# EAGLE design LB_BIT_i15_LIGHTTRIGGER-v02(rev1) (EAGLE 6.6.0)
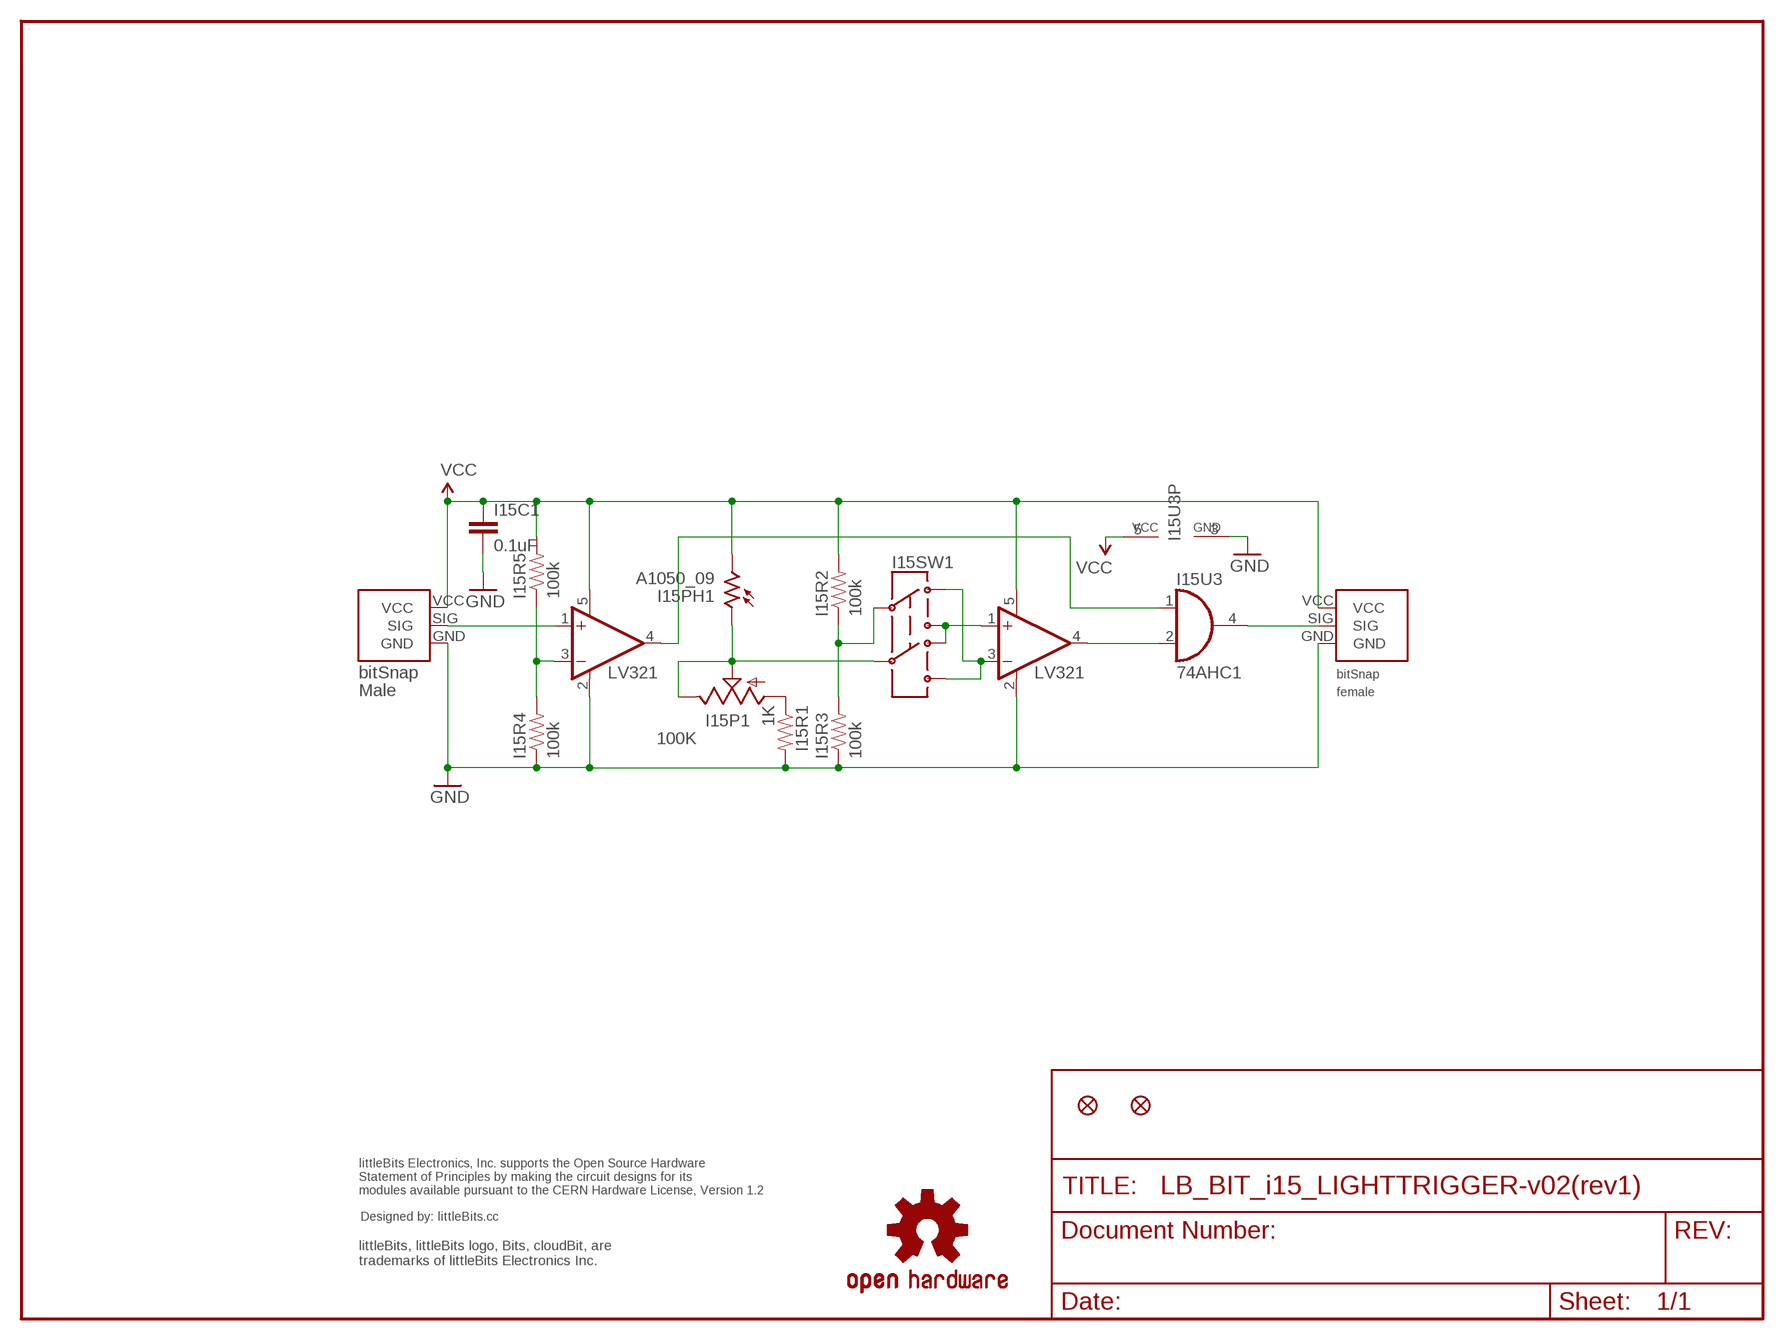
[diagram p0: schematic, sheet 1]

## Parts
I15BSF  BITSNAP_FEMALE  [BITSNAP_FEMALE]
I15BSM  BITSNAP_MALE  [BITSNAP_MALE]
I15C1  0.1uF  CAP0603-CAP  [0603-CAP]
I15FD1  FIDUCIAL1X2  [FIDUCIAL-1X2]
I15FD2  FIDUCIAL1X2  [FIDUCIAL-1X2]
I15P1  POT-TRIM-SMD-BOURNS-3303  [POT-TRIM-SMD-BOURNS-3303]
I15PH1  A1050_09  [T0-46-A10XX]
I15R1  1K  RESISTOR0603-RES  [0603-RES]
I15R2  100k  RESISTOR0603-RES  [0603-RES]
I15R3  100k  RESISTOR0603-RES  [0603-RES]
I15R4  100k  RESISTOR0603-RES  [0603-RES]
I15R5  100k  RESISTOR0603-RES  [0603-RES]
I15SW1  SWITCH-DPDTSMD  [AYZ0202]
I15U1  LV321  [SC70]
I15U2  LV321  [SC70]
I15U3  74AHC1  74LVC1G08DBV  [SOT23-5]
U$6  OSHW-LOGOL  [OSHW-LOGO-L]
U$7  OSHWCREDIT  [OSHWCREDIT]

## Nets
GND: I15BSF.GND I15BSM.GND I15C1.2 I15R1.2 I15R3.1 I15R4.1 I15U1.2(V-) I15U2.2(V-) I15U3.3(GND)
N$1: I15SW1.3 I15SW1.4 I15U2.1(+IN)
N$2: I15SW1.1 I15SW1.6 I15U2.3(-IN)
N$4: I15P1.1(A) I15R1.1
N$6: I15U2.4(OUT) I15U3.2(I1)
N$8: I15BSF.SIG I15U3.4(O)
N$9: I15R2.1 I15R3.2 I15SW1.2
N$10: I15P1.2(S) I15P1.3(E) I15PH1.1 I15SW1.5
N$11: I15BSM.SIG I15U1.1(+IN)
N$12: I15R4.2 I15R5.1 I15U1.3(-IN)
N$13: I15U1.4(OUT) I15U3.1(I0)
VCC: I15BSF.VCC I15BSM.VCC I15C1.1 I15PH1.2 I15R2.2 I15R5.2 I15U1.5(V+) I15U2.5(V+) I15U3.5(VCC)

## Notes on the sheet
- 100K

## Library data of the parts
I15BSF = bitSnap:BITSNAP_FEMALE
I15BSM = bitSnap:BITSNAP_MALE
I15C1 = SparkFun:CAP: Capacitor Standard 0603 ceramic capacitor, and 0.1" leaded capacitor.
I15FD1 I15FD2 = SparkFun:FIDUCIAL: Fiducial Alignment Points Various fiducial points for machine vision alignment.
I15P1 = LITTLEBITS:POT-TRIM-SMD-BOURNS-3303
I15PH1 = photo-elements:A10: Sensor Robust Light Sensing Applications Outdoor Light Sensing Application Source: http://optoelectronics.perkinelmer.com/content/Datasheets/DTS_PhotocellsA1050.pdf
I15R1-I15R5 = SparkFun:RESISTOR: Resistor Basic schematic elements and footprints for 0603, 1206, and PTH 1/10th watt (small) resistors.
I15SW1 = SparkFun:SWITCH-DPDT: DPDT Version of the COM-00597
I15U1 I15U2 = LITTLEBITS:LV321
I15U3 = 74xx-little-de:74*1G08: 2-input AND gate
U$6 = SparkFun_NEW:OSHW-LOGO: Open Source Hardware Logo This logo indicates the piece of hardware it is found on incorporates a OSHW license and/or adheres to the definition of open source hardware found here: http://freedomdefined.org/OSHW
U$7 = LITTLEBITS:OSHWCREDIT

## Board
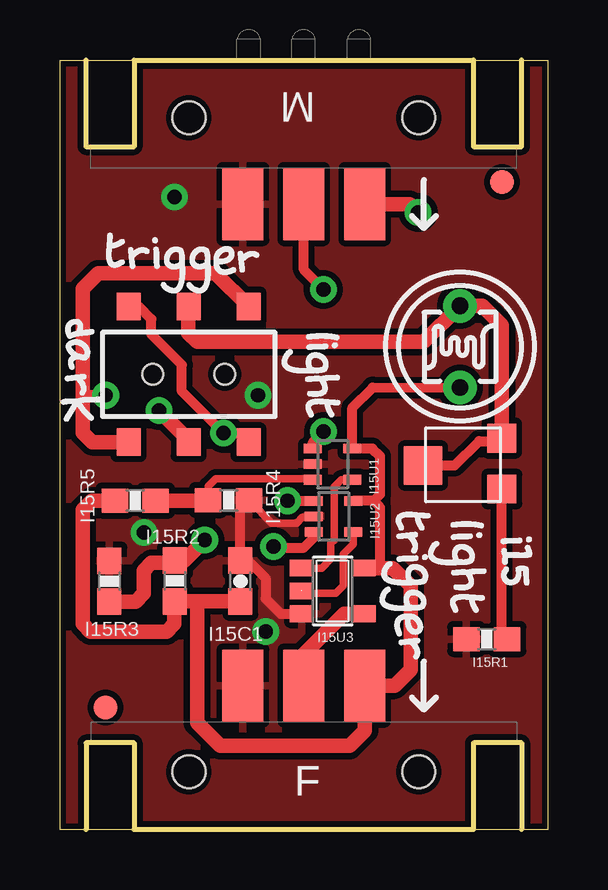
[diagram p1: board, top side]
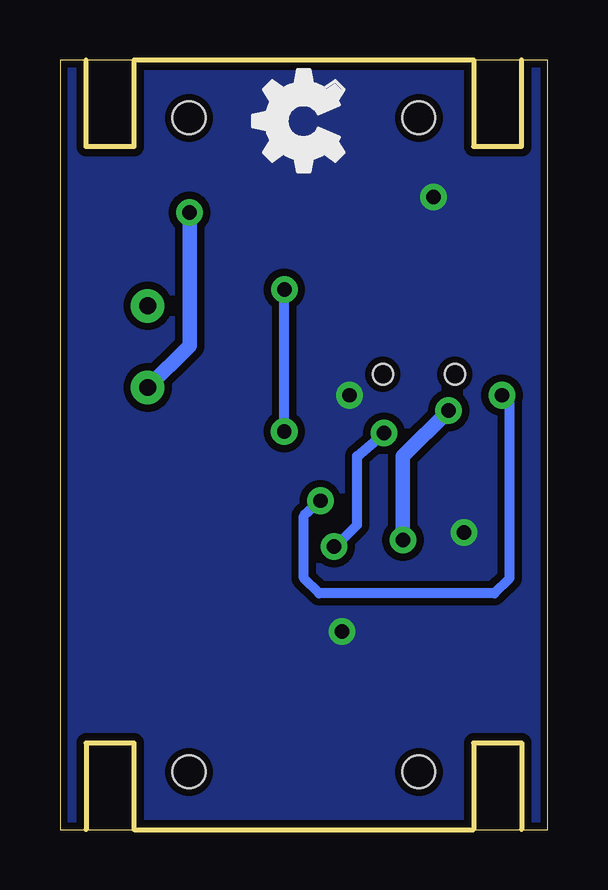
[diagram p2: board, bottom side, seen from below]

Size 20.32 x 32.07 mm. Coordinates in mm from the lower left corner, seen from the top.
Outline: 0,0 0,32.07 20.32,32.07 20.32,0 0,0
Copper layers (1*16): Top 0.035mm / dielectric 1.5mm / Bottom 0.035mm
Design rules "default": minimum track width 8mil, minimum drill 20mil, track to track 8mil, track to pad 8mil, pad to pad 8mil, via to via 8mil, smd to smd 8mil, copper to edge 10mil, drill to drill 8mil, minimum pad ring 12mil, minimum via ring 10mil, stop-mask expansion 4mil, vias tented up to drill 25mil, thermal gap 10mil

### Footprints (pad centres in the part's own frame; a part is rotated, then mirrored left to right if it is on the bottom)
BITSNAP_FEMALE = smd 1.7 x 3: GND 6.35,6; SIG 8.89,6; VCC 11.43,6 | hole 1.37: 13.68,2.41; 4.1,2.41
BITSNAP_MALE = smd 1.7 x 3: GND 11.43,6; SIG 8.89,6; VCC 6.35,6 | hole 1.37: 13.68,2.41; 4.1,2.41
0603-CAP = smd 1.1 x 1: 1 -0.85,0; 2 0.85,0
FIDUCIAL-1X2 = smd 1 x 1: 1 0,0
POT-TRIM-SMD-BOURNS-3303 = smd 1.2 x 1.2: 1 0.543,-3.172; 3 2.66,-3.168 | smd 1.6 x 1.6: 2 1.52,0.115
T0-46-A10XX = drill 0.7 pad 1.4: 1 -1.7,0; 2 1.7,0
0603-RES = smd 1.1 x 1: 1 -0.85,0; 2 0.85,0
AYZ0202 = smd 1 x 1.15: 1 -2.5,2.825; 2 0,2.825; 3 2.5,2.825; 4 -2.5,-2.825; 5 0,-2.825; 6 2.5,-2.825 | hole 0.85: 1.5,0; -1.5,0
SC70 = smd 0.4 x 0.75: 1 -0.65,-0.825; 2 0,-0.825; 3 0.65,-0.825; 4 0.65,0.825; 5 -0.65,0.825
SOT23-5 = smd 0.69 x 0.99: 1 -0.95,-1.29; 2 0,-1.29; 3 0.95,-1.29; 4 0.95,1.3; 5 -0.95,1.3

### Placement (x,y rotation side)
I15BSF  1.27,0 0 top
I15BSM  19.05,32.07 180 top
I15C1  7.52,10.36 90 top
I15FD1  1.91,5.08 0 top
I15FD2  18.41,26.99 0 top
I15P1  15.24,13.65 90 top
I15PH1  16.67,20.12 270 top
I15R1  17.78,7.94 180 top
I15R2  4.78,10.36 270 top
I15R3  2.06,10.35 270 top
I15R4  7.02,13.73 180 top
I15R5  3.13,13.71 180 top
I15SW1  5.36,18.97 180 top
I15U1  11.36,15.23 270 top
I15U2  11.4,13.05 270 top
I15U3  11.36,9.94 270 top
U$1  [T]  1.75,23.32 0 top
U$2  [R]  2.59,23.16 0 top
U$3  [I]  3.73,23.24 0 top
U$4  [G]  4.04,22.33 0 top
U$5  [D]  0.08,21.36 270 top
U$6  -12.7,-10.16 0 top  (outside the outline)
U$7  -16.51,-22.86 0 top  (outside the outline)
U$8  [OSHW_FILLX150_NOTEXT]  8.49,26.57 0 top
U$10  [A]  0,20.45 270 top
U$11  [R]  0,19.23 270 top
U$12  [K]  -0.08,18.16 270 top
U$13  [G]  5.11,22.33 0 top
U$14  [L]  10.13,20.79 270 top
U$15  [I]  10.13,20.41 270 top
U$16  [G]  9.22,20.18 270 top
U$17  [H]  9.98,18.96 270 top
U$18  [T]  10.13,18.12 270 top
U$19  [E]  6.17,22.94 0 top
U$20  [R]  7.16,23.01 0 top
U$36  [I]  18.22,12.32 270 top
U$37  [1]  18.36,11.96 270 top
U$38  [5]  18.14,11.13 270 top
U$39  [L]  16.15,12.95 270 top
U$40  [I]  16.15,12.5 270 top
U$41  [G]  15.32,12.19 270 top
U$42  [H]  16.08,10.9 270 top
U$43  [T]  16.15,9.98 270 top
U$44  [T]  13.89,13.41 270 top
U$45  [R]  13.82,12.65 270 top
U$46  [I]  13.89,11.58 270 top
U$47  [G]  13.37,11.35 270 top
U$48  [G]  13.3,10.29 270 top
U$49  [E]  13.75,9.22 270 top
U$50  [R]  13.91,8.23 270 top

### Tracks (layer width: path | path; a pad name or v marks a point on that pad's centre or on a via)
GND  (via drill 0.6)
  Top 0.305: 7.94,13.65 8.83,12.76 9.85,12.76 10.1,13.01 10.13,13.02 10.49,13.01 10.53,13.01 I15U2.2
  Top 0.406: 7.94,13.65 7.95,13.65 I15R4.1 7.52,13.37 I15C1.2 7.84,11.21 8.57,10.48 8.57,9.63 9.21,8.99 I15U3.3 | I15U3.3
  other vias: 3.49,12.38 8.57,8.26 8.26,18.1 4.76,26.35
  pour Top (isolate 0.254): 0.32,31.75 20,31.75 20,0.32 0.32,0.32
  pour Bottom (isolate 0.305): 0.32,31.75 20,31.75 20,0.32 0.32,0.32
N$1  (via drill 0.6)
  Top 0.406: I15U2.1 9.63,13.7 v9.47,13.7 | v1.91,18.1 1.27,18.1 0.95,17.78
  Top 0.61: I15SW1.3 1.34,16.15 0.96,16.53 0.95,17.78 0.95,22.54 1.59,23.18 6.47,23.18 I15SW1.4
  Bottom 0.406: v9.47,13.7 10.16,13.08 10.16,10.48 9.53,9.84 2.22,9.84 1.59,10.48 1.59,17.78 v1.91,18.1
N$2  (via drill 0.6)
  Top 0.406: I15U2.3 10.57,12.16 10.16,11.75 8.95,11.75 v8.9,11.8 | I15SW1.6 3.31,21.78 3.81,21.27 3.81,20.64 5.08,19.37 5.08,18.26 v6.82,16.52 7.7,16.51 I15SW1.1 7.94,16.14
  Bottom 0.406: v8.9,11.8 8.76,11.88 7.94,12.7 7.94,15.56 v6.82,16.52
N$4
  Top 0.406: I15R1.1 18.41,7.94 18.41,13.97 I15P1.1
N$6
  Top 0.305: I15U2.4 12.22,11.9 11.8,11.48 11.8,10.16 11.49,9.84 10.17,9.84 I15U3.2
N$8
  Top 0.61: I15U3.4 11.85,8.99 10.16,7.3 I15BSF.SIG
N$9  (via drill 0.6)
  Top 0.61: I15R3.2 3.15,9.5 3.49,9.84 3.49,10.79 3.81,11.11 4.69,11.11 I15R2.1 5.18,11.21 v6.03,12.06 | v4.13,17.46 5.14,16.45 I15SW1.2
  Bottom 0.61: v6.03,12.06 6.03,15.56 v4.13,17.46
N$10
  Top 0.305: I15P1.3 18.41,16.32
  Top 0.406: I15P1.2 16.44,15.17 17.46,16.19 18.41,16.19 18.41,16.32 18.41,16.51
  Top 0.61: I15SW1.5 5.34,20.69 5.71,20.32 15.16,20.32 I15PH1.1 17.6,21.82 18.41,21.02 I15P1.3
N$11  (via drill 0.6)
  Top 0.406: I15U1.1 10.54,16.14 v10.98,16.59 | v10.97,22.51 10.16,23.33 I15BSM.SIG
  Bottom 0.406: v10.98,16.59 v10.97,22.51
N$12
  Top 0.305: I15R4.2 6.17,14.31 6.49,14.63 10.59,14.63 I15U1.3
  Top 0.61: I15R5.1 6.16,13.71 I15R4.2
N$13
  Top 0.305: I15U1.4 11.71,14.58 11.43,14.29 11.43,12.06 11.29,11.93 11.29,11.28 10.91,10.89 I15U3.1
VCC  (via drill 0.6)
  Top 0.406: I15PH1.2 13.03,18.42 12.19,17.58 I15U1.5 13.02,15.88 13.34,15.56 13.34,13.97 13.06,13.7 | 13.06,13.7 I15U2.5 | 13.06,13.7 13.33,13.43 13.34,13.02 13.34,10.89 | 5.68,9.49 5.68,9.51 5.7,9.51 5.71,9.53 | I15C1.1
  Top 0.61: I15U3.5 13.34,10.89 13.87,10.89 14.61,10.16 14.61,6.67 13.94,6 I15BSF.VCC 12.7,4.13 12.06,3.49 6.67,3.49 5.71,4.45 5.71,9.53 5.73,9.51 | I15BSM.VCC 14.57,26.07 v14.92,25.72 | I15C1.1 5.68,9.51 I15R2.2 4.76,9.49 4.76,8.57 4.45,8.26 1.27,8.26 0.95,8.57 0.95,13.34 1.33,13.71 I15R5.2
  Bottom 0.61: v14.92,25.72 14.92,20.17 I15PH1.2